# Altium schematic sheet CHILD_BOARD.SchDoc
size D; SheetNumber: 1; SheetTotal: 11
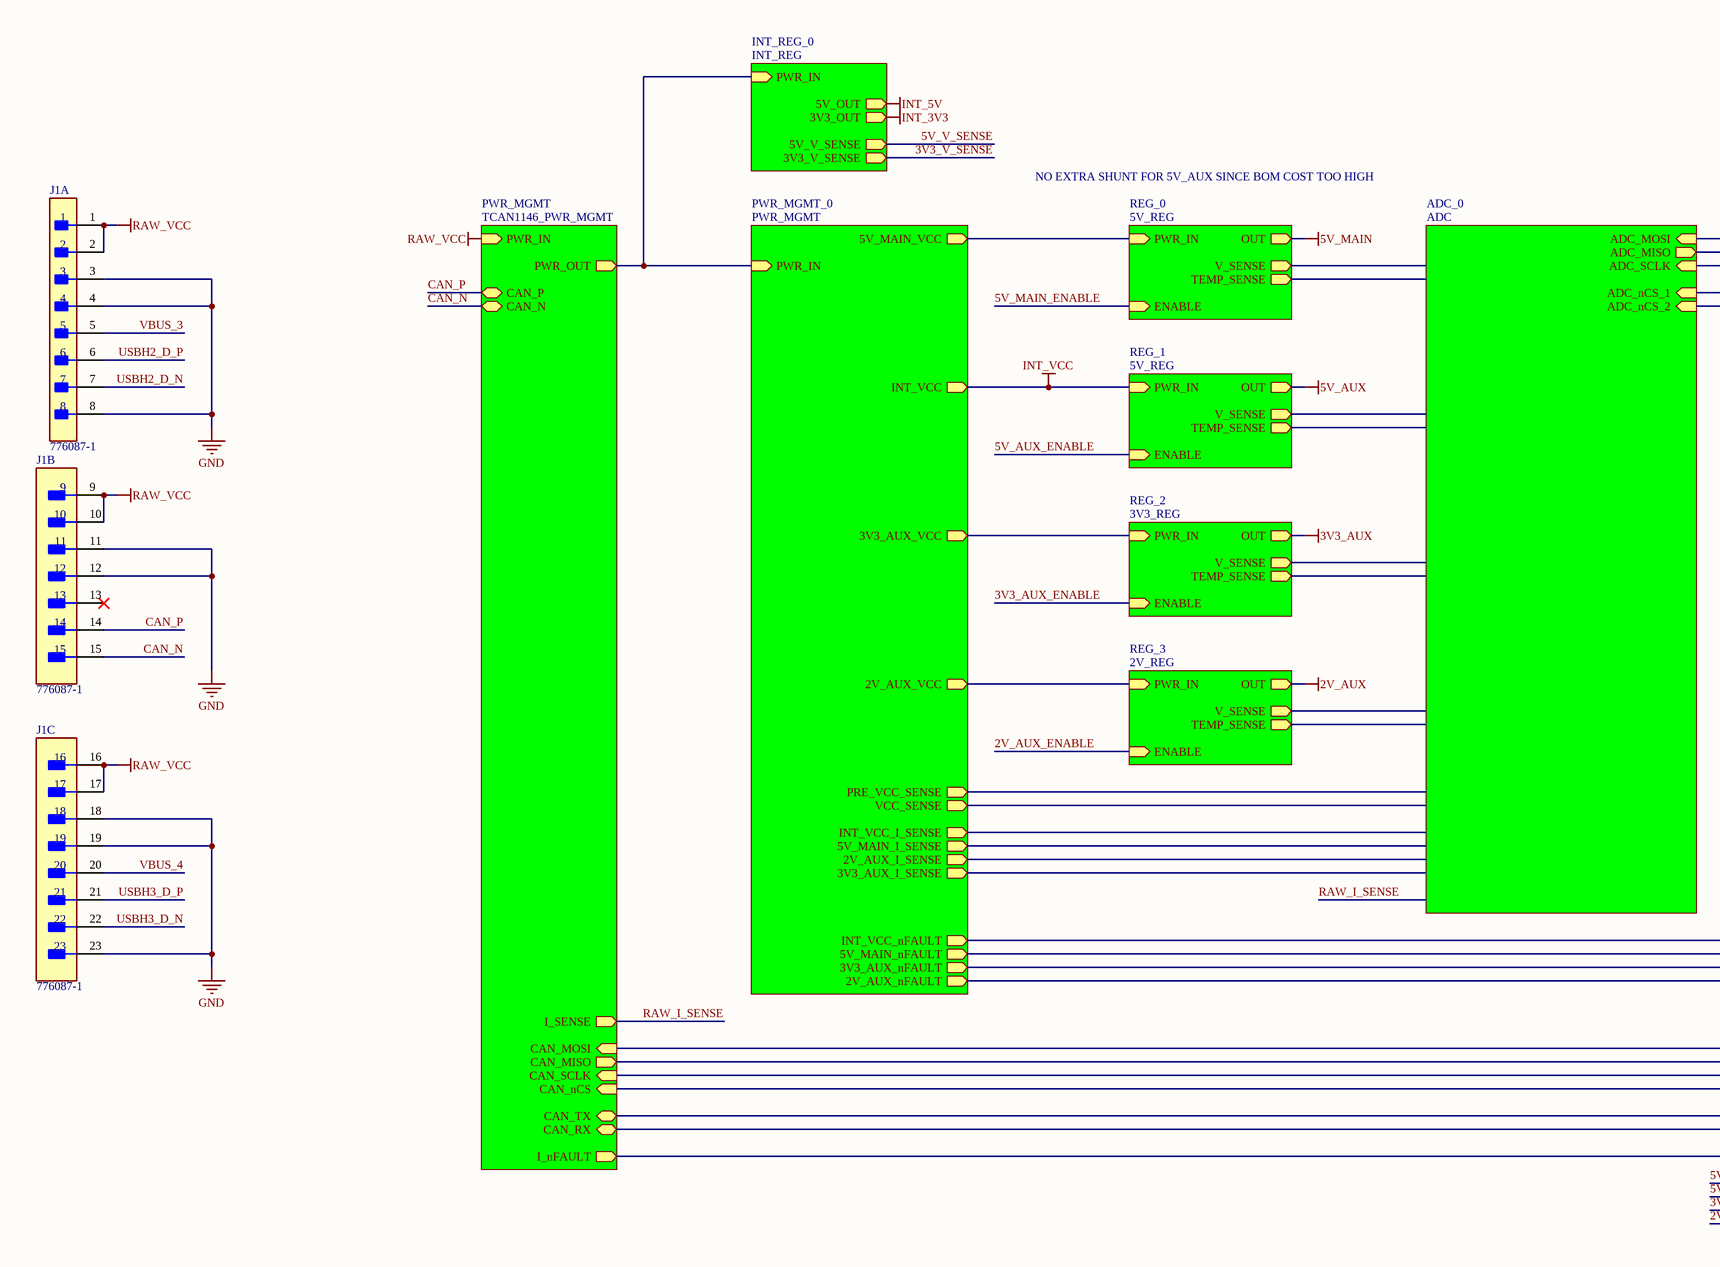
[diagram p0: CHILD_BOARD.SchDoc, left]
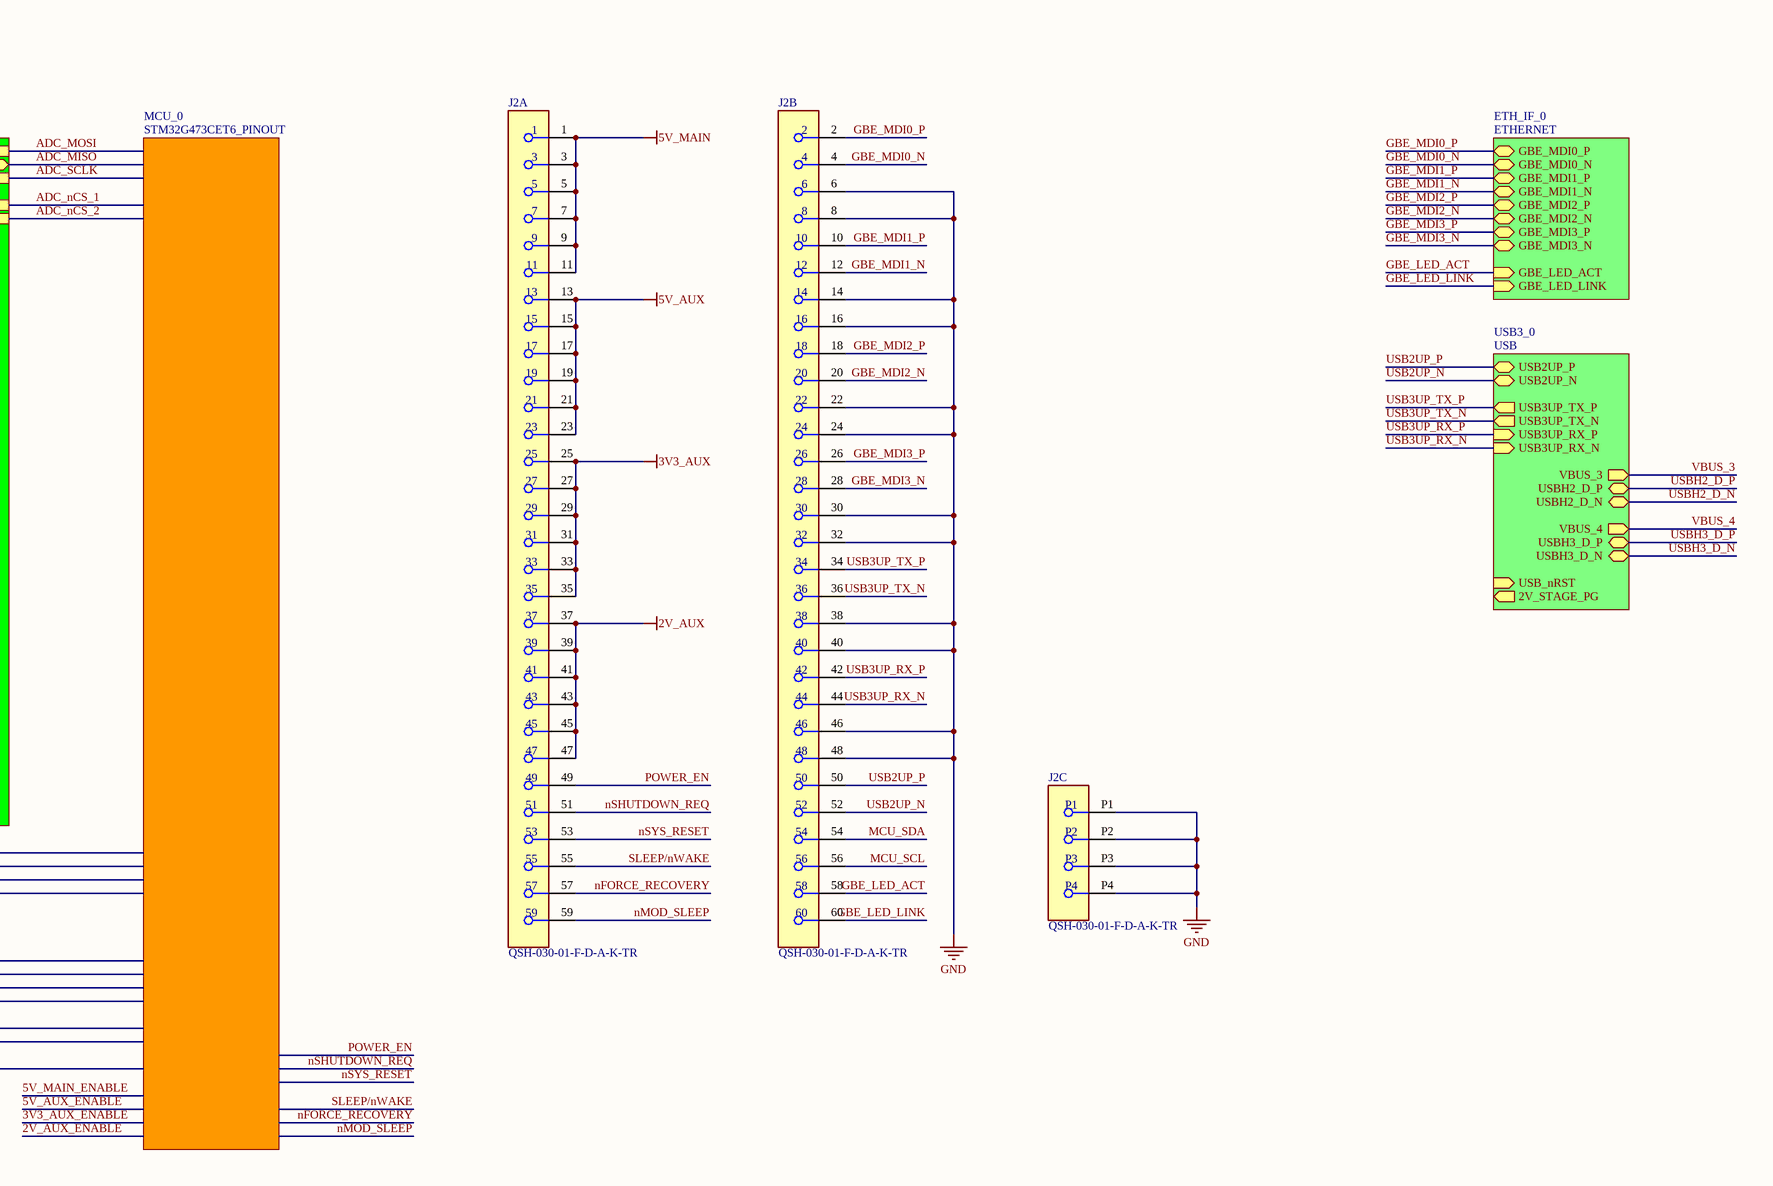
[diagram p1: CHILD_BOARD.SchDoc, right]

## Parts
J1  776087-1  [FP-776087-1-MFG]  (parts A,B,C of 3)
J2  QSH-030-01-F-D-A-K-TR  [FP-QSH-030-01-F-D-A-K-TR-MFG]  (parts A,B,C of 3)

## Sub-sheets
ADC_0 = ADC: ADC_SCLK (in), ADC_MISO (out), ADC_MOSI (in), ADC_nCS_1 (in), ADC_nCS_2 (in)
ETH_IF_0 = ETHERNET: GBE_MDI0_P (bidir), GBE_MDI0_N (bidir), GBE_MDI1_P (bidir), GBE_MDI1_N (bidir), GBE_MDI2_P (bidir), GBE_MDI2_N (bidir), GBE_MDI3_P (bidir), GBE_MDI3_N (bidir), GBE_LED_ACT (in), GBE_LED_LINK (in)
INT_REG_0 = INT_REG: PWR_IN (in), 5V_OUT (out), 3V3_OUT (out), 5V_V_SENSE (out), 3V3_V_SENSE (out)
MCU_0 = STM32G473CET6_PINOUT: no entries
PWR_MGMT = TCAN1146_PWR_MGMT: PWR_IN (in), PWR_OUT (out), CAN_MOSI (in), CAN_MISO (out), CAN_SCLK (in), CAN_nCS (in), CAN_TX (bidir), CAN_RX (bidir), I_SENSE (out), I_nFAULT (out), CAN_P (bidir), CAN_N (bidir)
PWR_MGMT_0 = PWR_MGMT: PWR_IN (in), INT_VCC (out), 5V_MAIN_VCC (out), 3V3_AUX_VCC (out), 2V_AUX_VCC (out), PRE_VCC_SENSE (out), VCC_SENSE (out), INT_VCC_I_SENSE (out), 5V_MAIN_I_SENSE (out), 2V_AUX_I_SENSE (out), 3V3_AUX_I_SENSE (out), INT_VCC_nFAULT (out), 5V_MAIN_nFAULT (out), 3V3_AUX_nFAULT (out), 2V_AUX_nFAULT (out)
REG_0 = 5V_REG: PWR_IN (in), OUT (out), V_SENSE (out), ENABLE (in), TEMP_SENSE (out)
REG_1 = 5V_REG: OUT (out), PWR_IN (in), ENABLE (in), V_SENSE (out), TEMP_SENSE (out)
REG_2 = 3V3_REG: PWR_IN (in), OUT (out), V_SENSE (out), ENABLE (in), TEMP_SENSE (out)
REG_3 = 2V_REG: PWR_IN (in), OUT (out), V_SENSE (out), ENABLE (in), TEMP_SENSE (out)
USB3_0 = USB: USB2UP_N (bidir), USB2UP_P (bidir), USB3UP_RX_N (in), USB3UP_RX_P (in), USB3UP_TX_N (out), USB3UP_TX_P (out), USBH2_D_N (bidir), VBUS_3 (out), USBH2_D_P (bidir), VBUS_4 (out), USBH3_D_N (bidir), USBH3_D_P (bidir), USB_nRST (in), 2V_STAGE_PG (out)

## Nets
2V_AUX: J2.37 J2.39 J2.41 J2.43 J2.45 J2.47 ; sheet REG_3/OUT
3V3_AUX: J2.25 J2.27 J2.29 J2.31 J2.33 J2.35 ; sheet REG_2/OUT
5V_AUX: J2.13 J2.15 J2.17 J2.19 J2.21 J2.23 ; sheet REG_1/OUT
5V_MAIN: J2.1 J2.3 J2.5 J2.7 J2.9 J2.11 ; sheet REG_0/OUT
GND: J1.3 J1.4 J1.8 J1.11 J1.12 J1.18 J1.19 J1.23 J2.6 J2.8 J2.14 J2.16 J2.22 J2.24 J2.30 J2.32 J2.38 J2.40 J2.46 J2.48 J2.P1 J2.P2 J2.P3 J2.P4
INT_3V3: sheet INT_REG_0/3V3_OUT
INT_5V: sheet INT_REG_0/5V_OUT
INT_VCC: sheet PWR_MGMT_0/INT_VCC, sheet REG_1/PWR_IN
RAW_VCC: J1.1 J1.2 J1.9 J1.10 J1.16 J1.17 ; sheet PWR_MGMT/PWR_IN
2V_AUX_ENABLE: sheet REG_3/ENABLE
3V3_AUX_ENABLE: sheet REG_2/ENABLE
3V3_V_SENSE: sheet INT_REG_0/3V3_V_SENSE
5V_AUX_ENABLE: sheet REG_1/ENABLE
5V_MAIN_ENABLE: sheet REG_0/ENABLE
5V_V_SENSE: sheet INT_REG_0/5V_V_SENSE
ADC_MISO: sheet ADC_0/ADC_MISO
ADC_MOSI: sheet ADC_0/ADC_MOSI
ADC_nCS_1: sheet ADC_0/ADC_nCS_1
ADC_nCS_2: sheet ADC_0/ADC_nCS_2
ADC_SCLK: sheet ADC_0/ADC_SCLK
CAN_N: J1.15 ; sheet PWR_MGMT/CAN_N
CAN_P: J1.14 ; sheet PWR_MGMT/CAN_P
GBE_LED_ACT: J2.58 ; sheet ETH_IF_0/GBE_LED_ACT
GBE_LED_LINK: J2.60 ; sheet ETH_IF_0/GBE_LED_LINK
GBE_MDI0_N: J2.4 ; sheet ETH_IF_0/GBE_MDI0_N
GBE_MDI0_P: J2.2 ; sheet ETH_IF_0/GBE_MDI0_P
GBE_MDI1_N: J2.12 ; sheet ETH_IF_0/GBE_MDI1_N
GBE_MDI1_P: J2.10 ; sheet ETH_IF_0/GBE_MDI1_P
GBE_MDI2_N: J2.20 ; sheet ETH_IF_0/GBE_MDI2_N
GBE_MDI2_P: J2.18 ; sheet ETH_IF_0/GBE_MDI2_P
GBE_MDI3_N: J2.28 ; sheet ETH_IF_0/GBE_MDI3_N
GBE_MDI3_P: J2.26 ; sheet ETH_IF_0/GBE_MDI3_P
MCU_SCL: J2.56
MCU_SDA: J2.54
nFORCE_RECOVERY: J2.57
nMOD_SLEEP: J2.59
nSHUTDOWN_REQ: J2.51
nSYS_RESET: J2.53
POWER_EN: J2.49
RAW_I_SENSE: sheet PWR_MGMT/I_SENSE
SLEEP/nWAKE: J2.55
USB2UP_N: J2.52 ; sheet USB3_0/USB2UP_N
USB2UP_P: J2.50 ; sheet USB3_0/USB2UP_P
USB3UP_RX_N: J2.44 ; sheet USB3_0/USB3UP_RX_N
USB3UP_RX_P: J2.42 ; sheet USB3_0/USB3UP_RX_P
USB3UP_TX_N: J2.36 ; sheet USB3_0/USB3UP_TX_N
USB3UP_TX_P: J2.34 ; sheet USB3_0/USB3UP_TX_P
USBH2_D_N: J1.7 ; sheet USB3_0/USBH2_D_N
USBH2_D_P: J1.6 ; sheet USB3_0/USBH2_D_P
USBH3_D_N: J1.22 ; sheet USB3_0/USBH3_D_N
USBH3_D_P: J1.21 ; sheet USB3_0/USBH3_D_P
VBUS_3: J1.5 ; sheet USB3_0/VBUS_3
VBUS_4: J1.20 ; sheet USB3_0/VBUS_4
(unnamed): sheet PWR_MGMT_0/PWR_IN, sheet PWR_MGMT/PWR_OUT, sheet INT_REG_0/PWR_IN
(unnamed): sheet PWR_MGMT_0/5V_MAIN_VCC, sheet REG_0/PWR_IN
(unnamed): sheet PWR_MGMT_0/3V3_AUX_VCC, sheet REG_2/PWR_IN
(unnamed): sheet PWR_MGMT_0/2V_AUX_VCC, sheet REG_3/PWR_IN

Not connected (* = marked no-connect by the designer): J1 13*

## Notes on the sheet
- NO EXTRA SHUNT FOR 5V_AUX SINCE BOM COST TOO HIGH

## Library data of the parts
J1 = CMP-03369-000157-2: CONN HEADER R/A 23POS 4MM; Max Voltage Rating (AC): 250V; PCB Thickness: 0.062inch; PCB Mount Alignment: Yes (With); Primary Type: Rectangular; Number of Signal Positions: 23; Row Spacing: 0.157inch; Current Rating: 17A; Connector System: Wire-to-Device; Number of Ports: 1; Shielding: Unshielded; PCB Mount Retention: With; Circuit Application: Power; Tab Thickness: 1.3mm; Gender: Male; Contact Shape: Circular; Mount: Through Hole; ELV: Compliant; Orientation: Right Angle; Lead Free: Lead Free; Contact Plating: Tin; Package Quantity: 1; RoHS Compliant: Yes; Connector Type: Header; Series: Ampseal; Termination: Solder; Voltage Rating (AC): 250V; Contact Material: Brass; Number of Rows: 3; Depth: 37.9mm; Housing Material: Polybutylene; Fastening Type: Ramp; Width: 37.9mm; Flammability Rating: UL94 V-0; Housing Color: Black; Radiation Hardening: No; Contact Type: Male Pin; Sealable: Yes (With); Length: 60.8mm; Max Operating Temperature: 221°C; Packaging: Bulk; Number of Positions: 23; Insulation Material: PBT; Pitch: 0.157inch; Contact Finish - Mating: TIN; Color: Black; Number of Terminals/Pins: 23; Insulation Color: Black; Number of Contacts: 23; Min Operating Temperature: -40°C
J2 = CMP-02761-000083-1: CONN RCPT 60POS SMD GOLD; Voltage Rating (AC): 125V; Pitch: 0.5mm; Number of Contacts: 60; Gender: Female; Contact Plating: Gold; Housing Material: Polymer; Min Operating Temperature: -55°C; Termination: Solder; Radiation Hardening: No; Max Operating Temperature: 125°C; Length: 21.27mm; Depth: 7.49mm; Mount: Surface Mount; Max Voltage Rating (AC): 125V; Contact Material: Bronze; Lead Free: Lead Free; Orientation: Straight; Number of Rows: 2; Housing Color: Black; Packaging: Tape and Reel